# Altium schematic sheet dtb-218-AW1.SchDoc
size C
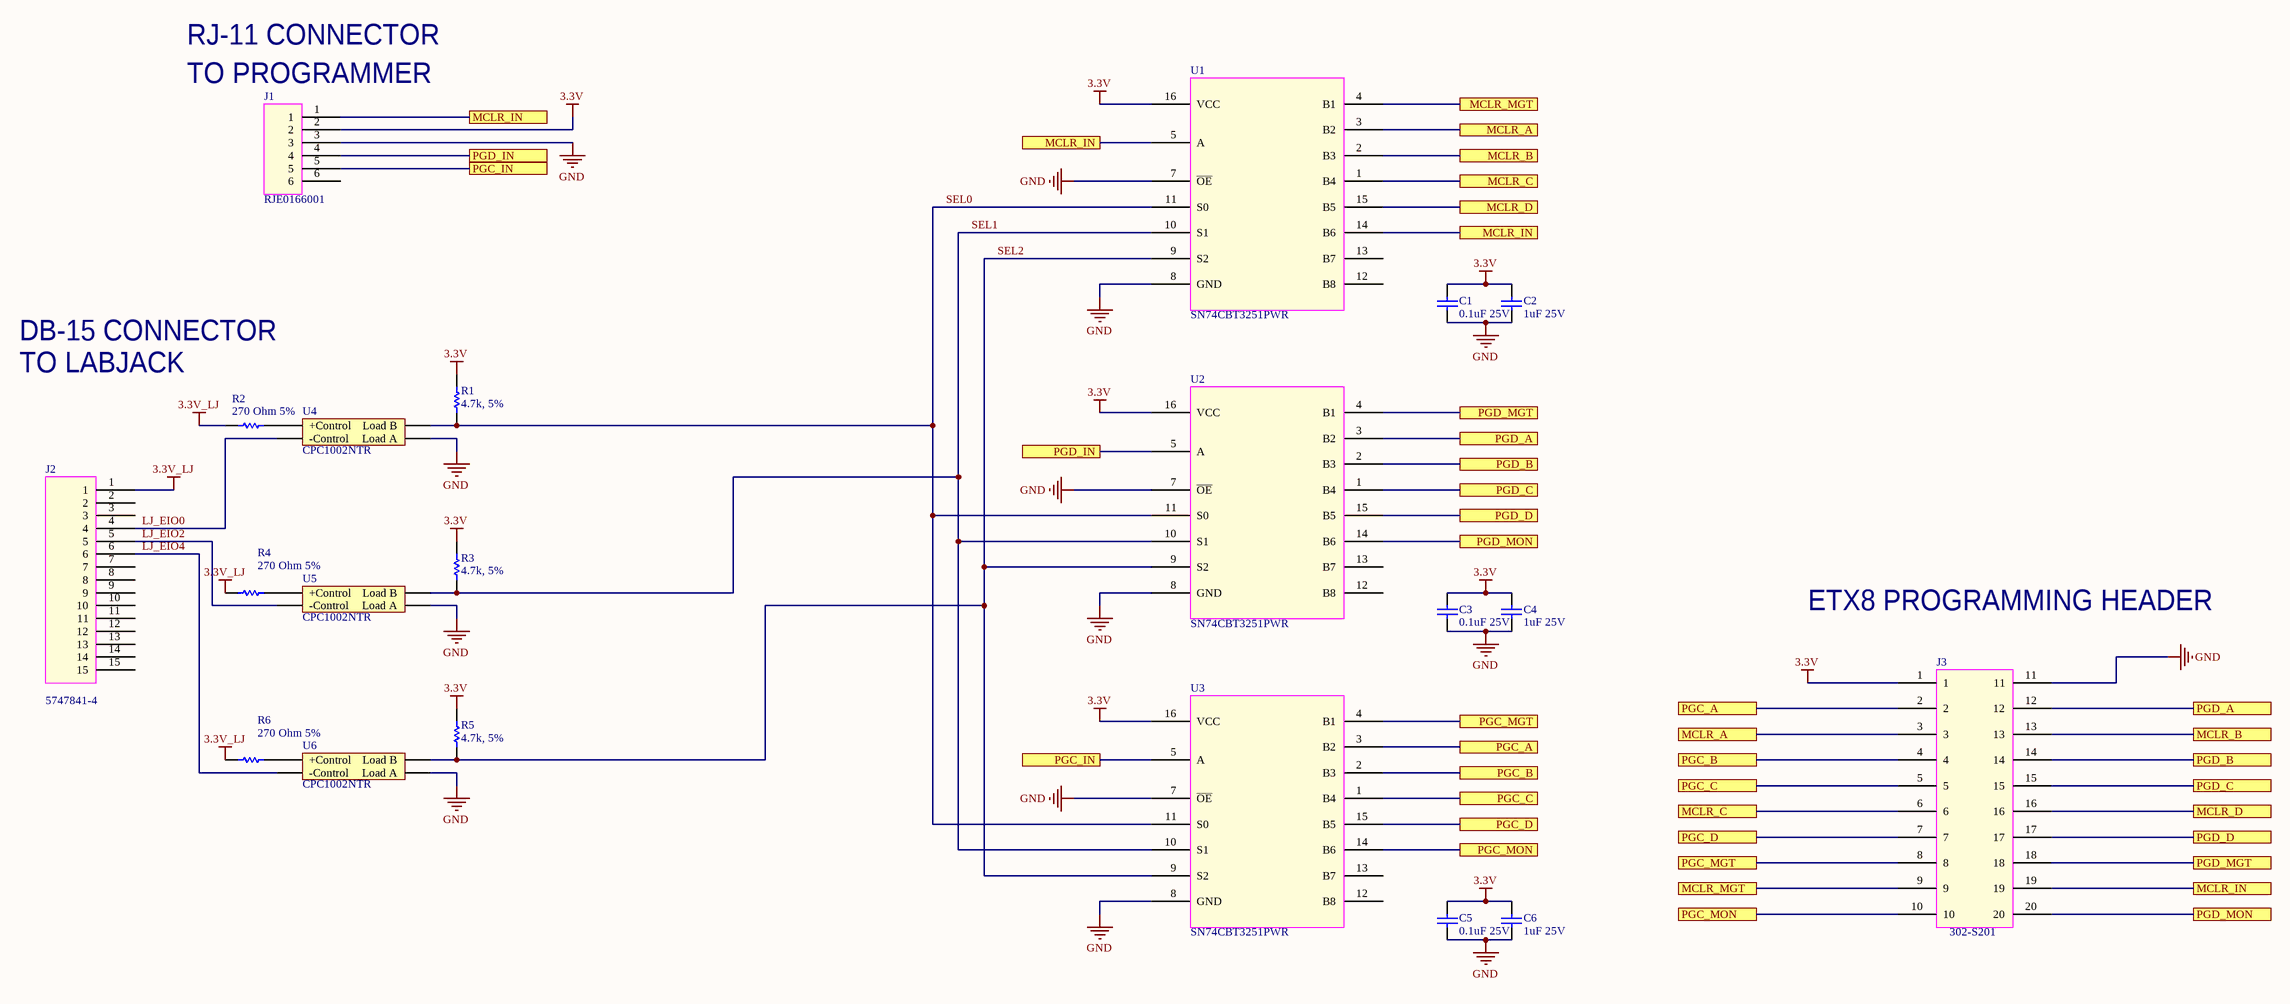
[diagram p0: dtb-218-AW1.SchDoc]

## Parts
C1  value 0.1uF 25V  [Standard VoltServer 0603 Capacitor Footprint]  (hidden comment: CL10B104KA8NNNC)
C2  value 1uF 25V  [Standard VoltServer 0603 Capacitor Footprint]  (hidden comment: CL10B105KA8NNNC)
C3  value 0.1uF 25V  [Standard VoltServer 0603 Capacitor Footprint]  (hidden comment: CL10B104KA8NNNC)
C4  value 1uF 25V  [Standard VoltServer 0603 Capacitor Footprint]  (hidden comment: CL10B105KA8NNNC)
C5  value 0.1uF 25V  [Standard VoltServer 0603 Capacitor Footprint]  (hidden comment: CL10B104KA8NNNC)
C6  value 1uF 25V  [Standard VoltServer 0603 Capacitor Footprint]  (hidden comment: CL10B105KA8NNNC)
J1  RJE0166001  [RJE0166001]
J2  5747841-4  [5747841-4]
J3  302-S201  [302-S201]
R1  value 4.7k, 5%  [Standard VoltServer 0603 Resistor Footprint]  (hidden comment: RC1608J472CS)
R2  value 270 Ohm 5%  [Standard VoltServer 0603 Resistor Footprint]  (hidden comment: RC1608J271CS)
R3  value 4.7k, 5%  [Standard VoltServer 0603 Resistor Footprint]  (hidden comment: RC1608J472CS)
R4  value 270 Ohm 5%  [Standard VoltServer 0603 Resistor Footprint]  (hidden comment: RC1608J271CS)
R5  value 4.7k, 5%  [Standard VoltServer 0603 Resistor Footprint]  (hidden comment: RC1608J472CS)
R6  value 270 Ohm 5%  [Standard VoltServer 0603 Resistor Footprint]  (hidden comment: RC1608J271CS)
U1  SN74CBT3251PWR  [SN74CBT3251PWR]
U2  SN74CBT3251PWR  [SN74CBT3251PWR]
U3  SN74CBT3251PWR  [SN74CBT3251PWR]
U4  CPC1002NTR  [CPC1002NTR]
U5  CPC1002NTR  [CPC1002NTR]
U6  CPC1002NTR  [CPC1002NTR]

## Ports
MCLR_A, MCLR_B, MCLR_C, MCLR_D, MCLR_IN, MCLR_MGT, PGC_A, PGC_B, PGC_C, PGC_D, PGC_IN, PGC_MGT, PGC_MON, PGD_A, PGD_B, PGD_C, PGD_D, PGD_IN, PGD_MGT, PGD_MON

## Nets
3.3V: C1.2 C2.2 C3.2 C4.2 C5.2 C6.2 J1.2 J3.1 R1.1 R3.1 R5.1 U1.16(VCC) U2.16(VCC) U3.16(VCC)
3.3V_LJ: J2.1 R2.1 R4.1 R6.1
GND: C1.1 C2.1 C3.1 C4.1 C5.1 C6.1 J1.3 J3.11 U1.7(~{OE}) U1.8(GND) U2.7(~{OE}) U2.8(GND) U3.7(~{OE}) U3.8(GND) U4.3(Load_A) U5.3(Load_A) U6.3(Load_A)
LJ_EIO0: J2.4 U4.2(-Control)
LJ_EIO2: J2.5 U5.2(-Control)
LJ_EIO4: J2.6 U6.2(-Control)
MCLR_A: J3.3 U1.3(B2) ; port MCLR_A
MCLR_B: J3.13 U1.2(B3) ; port MCLR_B
MCLR_C: J3.6 U1.1(B4) ; port MCLR_C
MCLR_D: J3.16 U1.15(B5) ; port MCLR_D
MCLR_IN: J1.1 J3.19 U1.5(A) U1.14(B6) ; port MCLR_IN
MCLR_MGT: J3.9 U1.4(B1) ; port MCLR_MGT
PGC_A: J3.2 U3.3(B2) ; port PGC_A
PGC_B: J3.4 U3.2(B3) ; port PGC_B
PGC_C: J3.5 U3.1(B4) ; port PGC_C
PGC_D: J3.7 U3.15(B5) ; port PGC_D
PGC_IN: J1.5 U3.5(A) ; port PGC_IN
PGC_MGT: J3.8 U3.4(B1) ; port PGC_MGT
PGC_MON: J3.10 U3.14(B6) ; port PGC_MON
PGD_A: J3.12 U2.3(B2) ; port PGD_A
PGD_B: J3.14 U2.2(B3) ; port PGD_B
PGD_C: J3.15 U2.1(B4) ; port PGD_C
PGD_D: J3.17 U2.15(B5) ; port PGD_D
PGD_IN: J1.4 U2.5(A) ; port PGD_IN
PGD_MGT: J3.18 U2.4(B1) ; port PGD_MGT
PGD_MON: J3.20 U2.14(B6) ; port PGD_MON
SEL0: R1.2 U1.11(S0) U2.11(S0) U3.11(S0) U4.4(Load_B)
SEL1: R3.2 U1.10(S1) U2.10(S1) U3.10(S1) U5.4(Load_B)
SEL2: R5.2 U1.9(S2) U2.9(S2) U3.9(S2) U6.4(Load_B)
NetR2_2: R2.2 U4.1(+Control)
NetR4_2: R4.2 U5.1(+Control)
NetR6_2: R6.2 U6.1(+Control)

Not connected (* = marked no-connect by the designer): J1 6; J2 2 3 7 8 9 10 11 12 13 14 15; U1 12(B8) 13(B7); U2 12(B8) 13(B7); U3 12(B8) 13(B7)

## Notes on the sheet
- RJ-11 CONNECTOR
- (near J1) TO PROGRAMMER
- DB-15 CONNECTOR
- TO LABJACK
- ETX8 PROGRAMMING HEADER

## Library data of the parts
C1 C3 C5 = CL10B104KA8NNNC: CAP CER 0.1UF 25V 10% X7R 0603; Manufacturer: Samsung; Vendor: Digikey; Vendor PN: 1276-1006-1-ND; Manufacturer PN: CL10B104KA8NNNC; ClassName: TX DSP A
C2 C4 C6 = CL10B105KA8NNNC: CAP CER 1UF 25V 10% X7R 0603; Manufacturer: Samsung; Vendor: Digikey; Vendor PN: 1276-1184-1-ND; Manufacturer PN: CL10B105KA8NNNC; ClassName: TX DSP A
J1 = RJE0166001: CONN MOD JACK 6P6C R/A UNSHLD; Manufacturer: Amphenol; Vendor: Digikey; Vendor PN: RJE0166001-ND; Manufacturer PN: RJE0166001
J2 = 5747841-4: CONN D-SUB PLUG 15POS R/A SOLDER; Manufacturer: TE Connectivity; Vendor: Digikey; Vendor PN: A32096-ND; Manufacturer PN: 5747841-4
J3 = 302-S201: 20 Positions Header, Shrouded Connector 0.100"; Manufacturer: On Shore Technology; Vendor: Digikey; Vendor PN: ED10524-ND; Manufacturer PN: 302-S201
R1 R3 R5 = RC1608F105CS: RES SMD 4.7K OHM 5% 1/10W 0603; Manufacturer: Samsung; Vendor: Digikey; Vendor PN: 1276-5078-6-ND; Manufacturer PN: RC1608J472CS
R2 R4 R6 = RC1608J271CS: RES SMD 270 OHM 5% 1/10W 0603; Manufacturer: Samsung; Vendor: Digikey; Vendor PN: 1276-5048-1-ND; Manufacturer PN: RC1608J271CS; ClassName: TX DSP A
U1-U3 = SN74CBT3251PWR: IC 1-OF-8 FET MUX/DEMUX 16-TSSOP; Manufacturer: Texas Instruments; Vendor: Digikey; Vendor PN: 296-6431-1-ND; Manufacturer PN: SN74CBT3251PWR; ClassName: Clearance Exceptions
U4-U6 = CPC1002NTR: RELAY OPTOMOS 700MA 4-SOP; Manufacturer: IXYS Integrated Circuits Division; Vendor: Digikey; Vendor PN: CLA230CT-ND; Manufacturer PN: CPC1002NTR